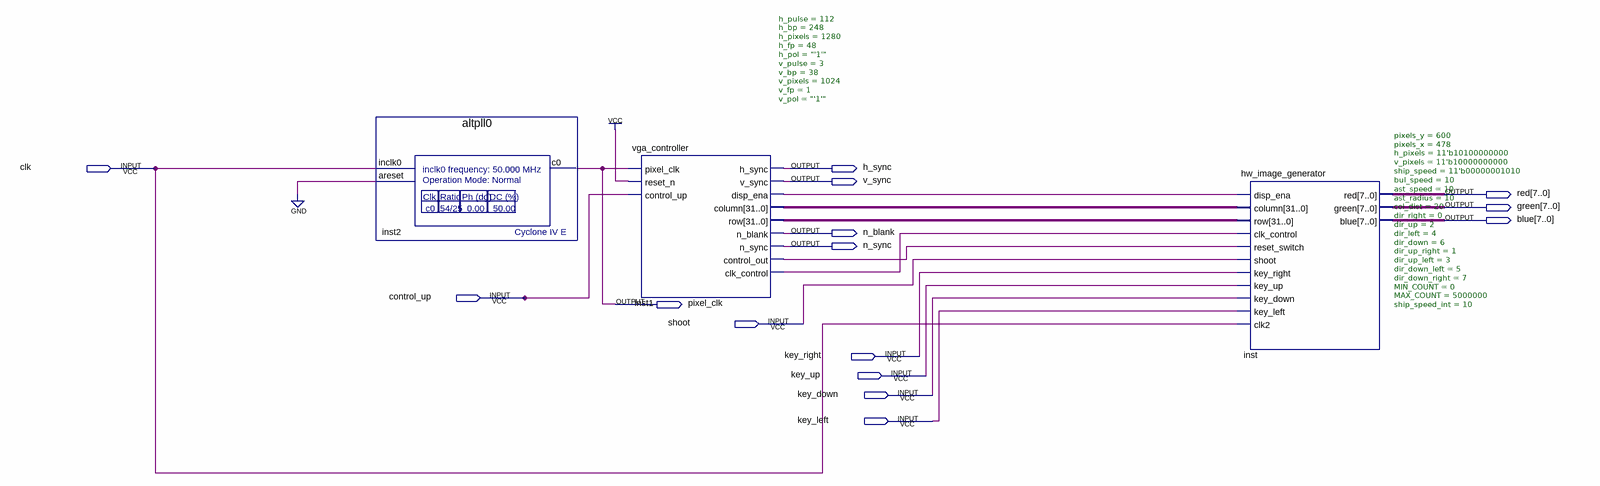
[diagram p0: schematic sheet]
// Quartus schematic vga_with_hw_test_image.bdf as structural Verilog: 3 symbols, 15 pins
module vga_with_hw_test_image (
  input  clk,
  input  control_up,
  input  shoot,
  input  key_right,
  input  key_up,
  input  key_down,
  input  key_left,
  output h_sync,
  output v_sync,
  output [7:0] red,
  output [7:0] green,
  output [7:0] blue,
  output n_blank,
  output n_sync,
  output pixel_clk
);

  wire inst1_clk_control, inst1_control_out, inst1_disp_ena;
  wire [31:0] inst1_column, inst1_row;

  altpll0 inst2 (.inclk0(clk), .areset(1'b0), .c0(pixel_clk));
  vga_controller #(.h_pulse(112), .h_bp(248), .h_pixels(1280), .h_fp(48), .h_pol("'1'"), .v_pulse(3), .v_bp(38), .v_pixels(1024), .v_fp(1), .v_pol("'1'")) inst1 (
    .pixel_clk(pixel_clk), .reset_n(1'b1), .control_up(control_up), .h_sync(h_sync), .v_sync(v_sync),
    .disp_ena(inst1_disp_ena), .column(inst1_column), .row(inst1_row), .n_blank(n_blank), .n_sync(n_sync),
    .control_out(inst1_control_out), .clk_control(inst1_clk_control));
  hw_image_generator #(.pixels_y(600), .pixels_x(478), .h_pixels(11'b10100000000), .v_pixels(11'b10000000000), .ship_speed(11'b00000001010), .bul_speed(10), .ast_speed(10), .ast_radius(10), .col_dist(20), .dir_right(0), .dir_up(2), .dir_left(4), .dir_down(6), .dir_up_right(1), .dir_up_left(3), .dir_down_left(5), .dir_down_right(7), .MIN_COUNT(0), .MAX_COUNT(5000000), .ship_speed_int(10)) inst (
    .disp_ena(inst1_disp_ena), .column(inst1_column), .row(inst1_row), .clk_control(inst1_clk_control),
    .reset_switch(inst1_control_out), .shoot(shoot), .key_right(key_right), .key_up(key_up),
    .key_down(key_down), .key_left(key_left), .clk2(clk), .red(red), .green(green), .blue(blue));
endmodule
